# Altium schematic sheet 03.SchDoc
size 459 x 350 mm
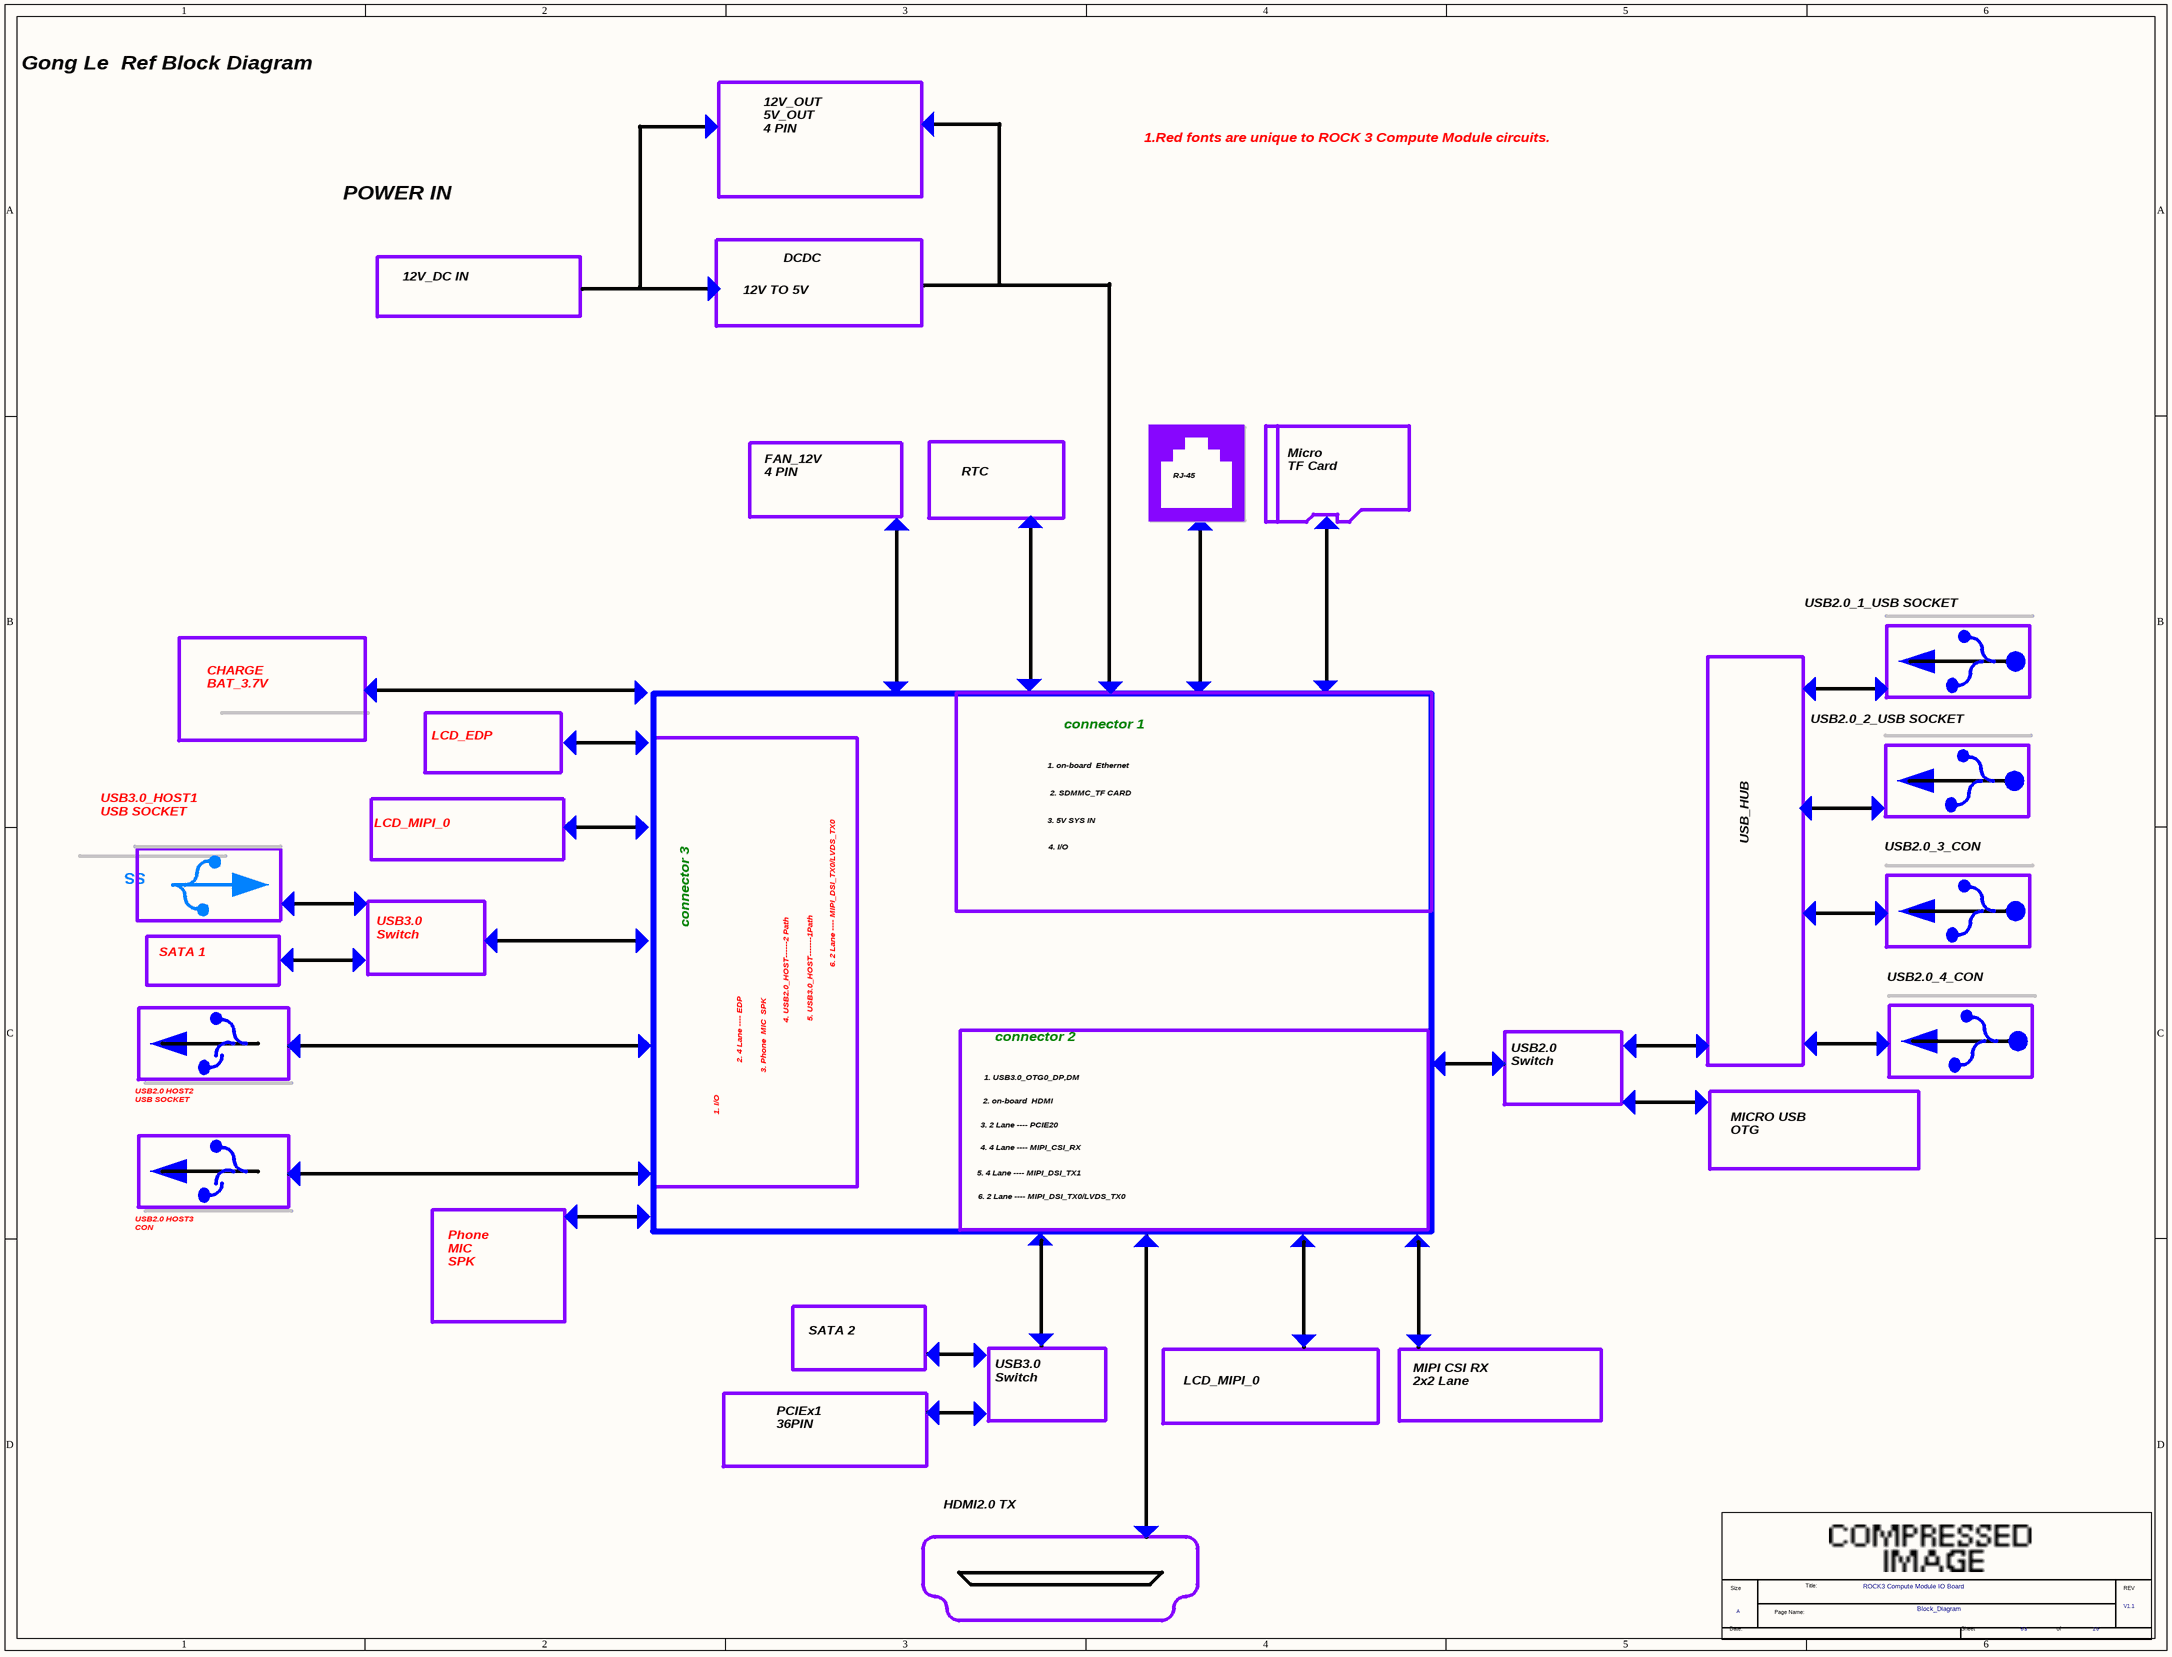
[diagram p0: 03.SchDoc]

## Parts
*  Page Count: 20  Page Number: 03  Page Size: A  Title: ROCK3 Compute Module IO Board  RevCode: V1.1  Doc: Block_Diagram  (hidden comment: radxa_gong)  (graphical)

## Notes on the sheet
- Gong Le  Ref Block Diagram
- 12V_OUT
  5V_OUT
  4 PIN
- 1.Red fonts are unique to ROCK 3 Compute Module circuits.
- POWER IN
- 12V_DC IN
- 12V TO 5V
- DCDC
- FAN_12V
  4 PIN
- RTC
- RJ-45
- Micro
  TF Card
- CHARGE
  BAT_3.7V
- USB2.0_1_USB SOCKET
- LCD_EDP
- 1. on-board  Ethernet
- connector 1
- USB2.0_2_USB SOCKET
- USB3.0_HOST1
  USB SOCKET
- LCD_MIPI_0
- 3. 5V SYS IN
- 2. SDMMC_TF CARD
- USB_HUB
- SS
- 4. I/O
- USB2.0_3_CON
- SATA 1
- USB3.0
  Switch
- connector 3
- 5. USB3.0_HOST-------1Path
- 6. 2 Lane ---- MIPI_DSI_TX0/LVDS_TX0
- USB2.0_4_CON
- 2. 4 Lane ---- EDP
- 3. Phone  MIC  SPK
- 4. USB2.0_HOST------2 Path
- 1. USB3.0_OTG0_DP,DM
- connector 2
- USB2.0
  Switch
- USB2.0 HOST2
  USB SOCKET
- 1. I/O
- 3. 2 Lane ---- PCIE20
- 2. on-board  HDMI
- MICRO USB
  OTG
- 5. 4 Lane ---- MIPI_DSI_TX1
- 4. 4 Lane ---- MIPI_CSI_RX
- USB2.0 HOST3
  CON
- Phone
  MIC
  SPK
- SATA 2
- MIPI CSI RX
  2x2 Lane
- PCIEx1
  36PIN
- HDMI2.0 TX
- (in symbol radxa_gong) Size; Title:; REV; Page Name:; Date:; Sheet; of

## Library data of the parts
* = radxa_gong: Page Create Date: March  8, 1995